# Altium project test.PrjPcb
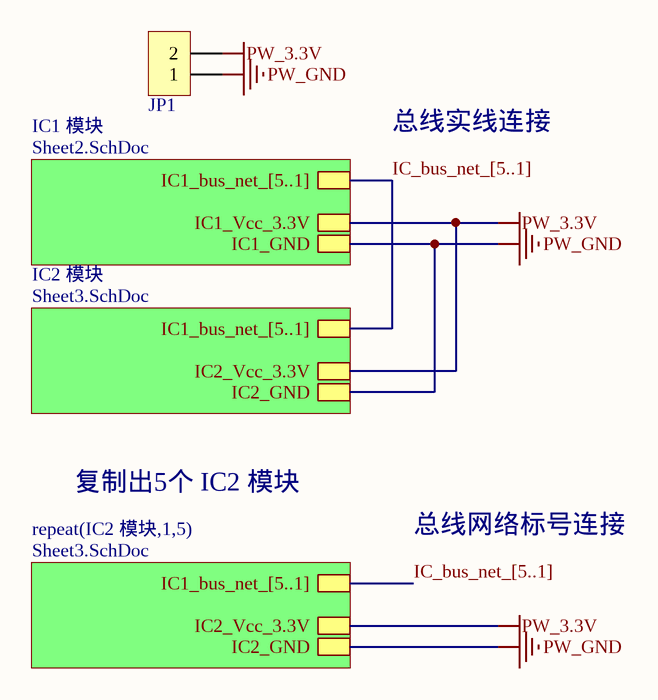
[diagram p0: Top.SchDoc]
2 sheets, 13 parts. Net scope: hierarchical (ports join the sheet entries above them; power ports are global).
Board file: PCB1.PcbDoc
Sheets:
  Top.SchDoc
    IC2 模块 = Sheet3.SchDoc
    IC2 模块1 = Sheet3.SchDoc
    IC2 模块2 = Sheet3.SchDoc
    IC2 模块3 = Sheet3.SchDoc
    IC2 模块4 = Sheet3.SchDoc
    IC2 模块5 = Sheet3.SchDoc

## Sheet Top.SchDoc
size A4

### Parts
JP1  HDR-1X2  [HDR2.54-LI-2P]  (value not drawn)

### Sub-sheets
IC1 模块 = Sheet2.SchDoc (file not in this document): IC1_bus_net_[5..1], IC1_Vcc_3.3V, IC1_GND
IC2 模块 = Sheet3.SchDoc: IC1_bus_net_[5..1], IC2_Vcc_3.3V, IC2_GND
repeat(IC2 模块,1,5) = Sheet3.SchDoc: IC1_bus_net_[5..1], IC2_Vcc_3.3V, IC2_GND

### Nets
PW_3.3V: JP1.2 ; sheet IC1 模块/IC1_Vcc_3.3V, sheet IC2 模块/IC2_Vcc_3.3V, sheet repeat(IC2 模块,1,5)/IC2_Vcc_3.3V  [project net IC2_Vcc_3.3V]
PW_GND: JP1.1 ; sheet IC1 模块/IC1_GND, sheet IC2 模块/IC2_GND, sheet repeat(IC2 模块,1,5)/IC2_GND  [project net IC2_GND]

### Buses and harness runs
bus IC_bus_net_[5..1] = sheet IC1 模块/IC1_bus_net_[5..1] = sheet IC2 模块/IC1_bus_net_[5..1]
bus IC_bus_net_[5..1] = sheet repeat(IC2 模块,1,5)/IC1_bus_net_[5..1]

### Notes on the sheet
- 总线实线连接
- 复制出5个 IC2 模块
- 总线网络标号连接

### Library data of the parts
JP1 = Header 2: 2P接插件; 版权归属: 源创客; BOM名称: 2P接插件; 学习资源: www.ooocke.com

## Sheet Sheet3.SchDoc
size A4
Used 6 times, as channels IC2 模块, IC2 模块1, IC2 模块2, IC2 模块3, IC2 模块4, IC2 模块5. Parts and nets are listed once, with the designators drawn on the sheet.
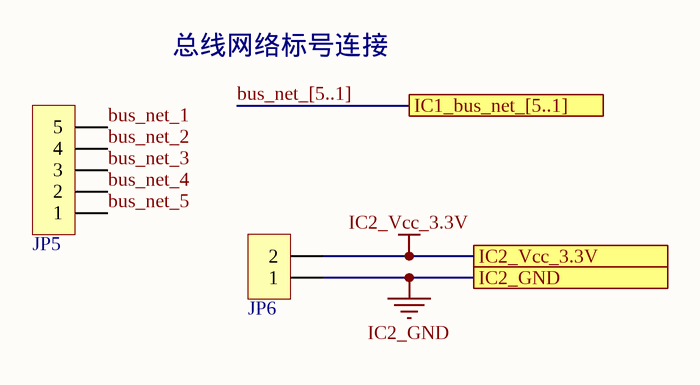
[diagram p1: Sheet3.SchDoc]

### Parts
JP5  HDR-1X5  [HDR2.54-LI-5P]  (value not drawn)
JP6  HDR-1X2  [HDR2.54-LI-2P]  (value not drawn)

### Ports
IC1_bus_net_[5..1], IC2_GND, IC2_Vcc_3.3V

### Nets
IC2_GND: JP6.1 ; port IC2_GND
IC2_Vcc_3.3V: JP6.2 ; port IC2_Vcc_3.3V
bus_net_1: JP5.5
bus_net_2: JP5.4
bus_net_3: JP5.3
bus_net_4: JP5.2
bus_net_5: JP5.1

### Channels
IC2 模块: designators end in _IC2_模块; ports IC2_GND=IC2_GND IC2_Vcc_3.3V=IC2_Vcc_3.3V
IC2 模块1: designators end in _IC2_模块1; ports IC2_GND=IC2_GND IC2_Vcc_3.3V=IC2_Vcc_3.3V
IC2 模块2: designators end in _IC2_模块2; ports IC2_GND=IC2_GND IC2_Vcc_3.3V=IC2_Vcc_3.3V
IC2 模块3: designators end in _IC2_模块3; ports IC2_GND=IC2_GND IC2_Vcc_3.3V=IC2_Vcc_3.3V
IC2 模块4: designators end in _IC2_模块4; ports IC2_GND=IC2_GND IC2_Vcc_3.3V=IC2_Vcc_3.3V
IC2 模块5: designators end in _IC2_模块5; ports IC2_GND=IC2_GND IC2_Vcc_3.3V=IC2_Vcc_3.3V

### Buses and harness runs
bus bus_net_[5..1] = port IC1_bus_net_[5..1]

### Notes on the sheet
- 总线网络标号连接

### Library data of the parts
JP5 = Header 5: 5P接插件; 版权归属: 源创客; BOM名称: 5P接插件; 学习资源: www.ooocke.com
JP6 = Header 2: 2P接插件; 版权归属: 源创客; BOM名称: 2P接插件; 学习资源: www.ooocke.com

## Nets that join several sheets
IC2_GND: Top (JP1.1), IC2 模块 (JP6_IC2_模块.1), IC2 模块1 (JP6_IC2_模块1.1), IC2 模块2 (JP6_IC2_模块2.1), IC2 模块3 (JP6_IC2_模块3.1), IC2 模块4 (JP6_IC2_模块4.1), IC2 模块5 (JP6_IC2_模块5.1)
IC2_Vcc_3.3V: Top (JP1.2), IC2 模块 (JP6_IC2_模块.2), IC2 模块1 (JP6_IC2_模块1.2), IC2 模块2 (JP6_IC2_模块2.2), IC2 模块3 (JP6_IC2_模块3.2), IC2 模块4 (JP6_IC2_模块4.2), IC2 模块5 (JP6_IC2_模块5.2)
bus_net_1: IC2 模块 (JP5_IC2_模块.5), IC2 模块1 (JP5_IC2_模块1.5), IC2 模块2 (JP5_IC2_模块2.5), IC2 模块3 (JP5_IC2_模块3.5), IC2 模块4 (JP5_IC2_模块4.5), IC2 模块5 (JP5_IC2_模块5.5)
bus_net_2: IC2 模块 (JP5_IC2_模块.4), IC2 模块1 (JP5_IC2_模块1.4), IC2 模块2 (JP5_IC2_模块2.4), IC2 模块3 (JP5_IC2_模块3.4), IC2 模块4 (JP5_IC2_模块4.4), IC2 模块5 (JP5_IC2_模块5.4)
bus_net_3: IC2 模块 (JP5_IC2_模块.3), IC2 模块1 (JP5_IC2_模块1.3), IC2 模块2 (JP5_IC2_模块2.3), IC2 模块3 (JP5_IC2_模块3.3), IC2 模块4 (JP5_IC2_模块4.3), IC2 模块5 (JP5_IC2_模块5.3)
bus_net_4: IC2 模块 (JP5_IC2_模块.2), IC2 模块1 (JP5_IC2_模块1.2), IC2 模块2 (JP5_IC2_模块2.2), IC2 模块3 (JP5_IC2_模块3.2), IC2 模块4 (JP5_IC2_模块4.2), IC2 模块5 (JP5_IC2_模块5.2)
bus_net_5: IC2 模块 (JP5_IC2_模块.1), IC2 模块1 (JP5_IC2_模块1.1), IC2 模块2 (JP5_IC2_模块2.1), IC2 模块3 (JP5_IC2_模块3.1), IC2 模块4 (JP5_IC2_模块4.1), IC2 模块5 (JP5_IC2_模块5.1)